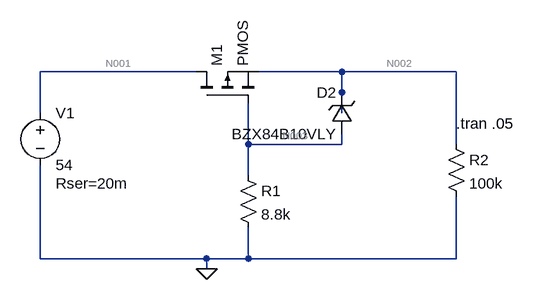
[diagram p0: schematic reverse_input_polarity.asc]
reverse_input_polarity.asc, the LTspice schematic file:
Version 4
SHEET 1 880 680
WIRE 112 -112 -128 -112
WIRE 336 -112 208 -112
WIRE 512 -112 336 -112
WIRE 336 -80 336 -112
WIRE -128 -48 -128 -112
WIRE 336 -48 336 -80
WIRE 192 0 192 -64
WIRE 336 0 336 -16
WIRE 336 0 192 0
WIRE 512 0 512 -112
WIRE 192 48 192 0
WIRE -128 176 -128 32
WIRE 128 176 -128 176
WIRE 192 176 192 128
WIRE 192 176 128 176
WIRE 512 176 512 80
WIRE 512 176 192 176
WIRE 128 192 128 176
FLAG 128 192 0
SYMBOL res 176 32 R0
SYMATTR InstName R1
SYMATTR Value 8.8k
SYMBOL voltage -128 -64 R0
WINDOW 123 0 0 Left 0
WINDOW 39 24 124 Left 2
SYMATTR InstName V1
SYMATTR Value 54
SYMATTR SpiceLine Rser=20m
SYMBOL pmos 112 -64 R270
SYMATTR InstName M1
SYMBOL zener 352 -16 R180
WINDOW 0 24 64 Left 2
WINDOW 3 24 0 Left 2
SYMATTR InstName D2
SYMATTR Value BZX84B10VLY
SYMBOL res 496 -16 R0
SYMATTR InstName R2
SYMATTR Value 100k
TEXT 512 -32 Left 2 !.tran .05

The netlist it stands for:
* reverse_input_polarity.asc
R1 N003 0 8.8k
V1 N001 0 54 Rser=20m
M1 N001 N003 N002 N002 PMOS
D2 N003 N002 BZX84B10VLY
R2 N002 0 100k
.model D D
.lib standard.dio
.model NMOS NMOS
.model PMOS PMOS
.lib standard.mos
.tran .05
.backanno
.end

* Results of the author's LTspice run, read from the files saved beside the schematic
* Operating Point, zero values left out:
*   V(n003) = 43.26 V
*   V(n001) = 54 V
*   V(n002) = 53.3 V
*   Id(M1) = 5.449 mA
*   Ib(M1) = -5.304 mA
*   Is(M1) = -145.1 µA
*   I(D2) = -4.916 mA
*   I(R1) = 4.916 mA
*   I(R2) = 533 µA
*   I(V1) = -5.449 mA